# Altium project Choin1_0.PrjPCB (part 2 of 2)
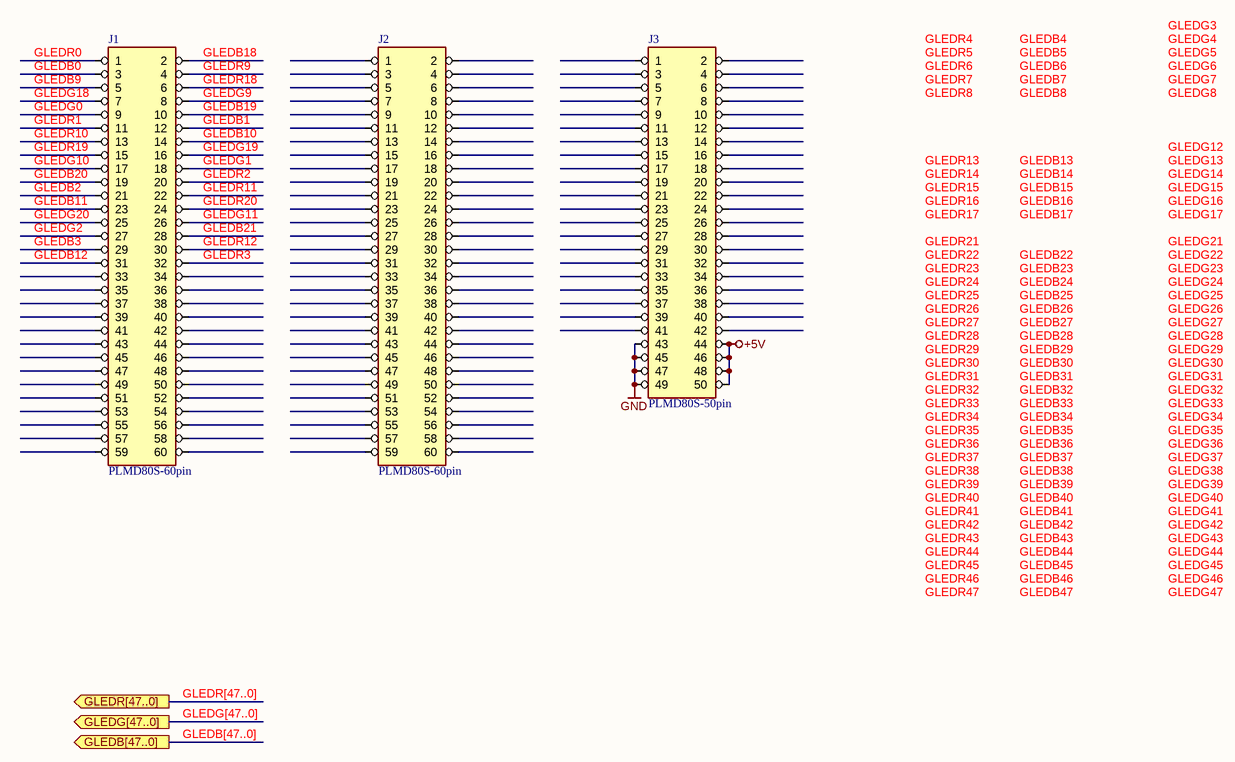
[diagram p5: Choin_zlacza.SchDoc]

## Nets that join several sheets
+5V: Choin_led1_0 (135 pins), Choin_zlacza (J3.44 J3.46 J3.48 J3.50)
GND: Choin_tran1_0 (192 pins), Choin_zlacza (J3.43 J3.45 J3.47 J3.49)
GLEDB0: Choin_tran1_0 (T1.5), Choin_zlacza (J1.3)
GLEDB1: Choin_tran1_0 (T3.5), Choin_zlacza (J1.12)
GLEDB2: Choin_tran1_0 (T5.5), Choin_zlacza (J1.21)
GLEDB3: Choin_tran1_0 (T7.5), Choin_zlacza (J1.29)
GLEDB9: Choin_tran1_0 (T19.5), Choin_zlacza (J1.5)
GLEDB10: Choin_tran1_0 (T21.5), Choin_zlacza (J1.14)
GLEDB11: Choin_tran1_0 (T23.5), Choin_zlacza (J1.23)
GLEDB12: Choin_tran1_0 (T25.5), Choin_zlacza (J1.31)
GLEDB18: Choin_tran1_0 (T37.5), Choin_zlacza (J1.2)
GLEDB19: Choin_tran1_0 (T39.5), Choin_zlacza (J1.10)
GLEDB20: Choin_tran1_0 (T41.5), Choin_zlacza (J1.19)
GLEDB21: Choin_tran1_0 (T43.5), Choin_zlacza (J1.28)
GLEDG0: Choin_tran1_0 (T2.2), Choin_zlacza (J1.9)
GLEDG1: Choin_tran1_0 (T4.2), Choin_zlacza (J1.18)
GLEDG2: Choin_tran1_0 (T6.2), Choin_zlacza (J1.27)
GLEDG9: Choin_tran1_0 (T20.2), Choin_zlacza (J1.8)
GLEDG10: Choin_tran1_0 (T22.2), Choin_zlacza (J1.17)
GLEDG11: Choin_tran1_0 (T24.2), Choin_zlacza (J1.26)
GLEDG18: Choin_tran1_0 (T38.2), Choin_zlacza (J1.7)
GLEDG19: Choin_tran1_0 (T40.2), Choin_zlacza (J1.16)
GLEDG20: Choin_tran1_0 (T42.2), Choin_zlacza (J1.25)
GLEDR0: Choin_tran1_0 (T1.2), Choin_zlacza (J1.1)
GLEDR1: Choin_tran1_0 (T3.2), Choin_zlacza (J1.11)
GLEDR2: Choin_tran1_0 (T5.2), Choin_zlacza (J1.20)
GLEDR3: Choin_tran1_0 (T7.2), Choin_zlacza (J1.32)
GLEDR9: Choin_tran1_0 (T19.2), Choin_zlacza (J1.4)
GLEDR10: Choin_tran1_0 (T21.2), Choin_zlacza (J1.13)
GLEDR11: Choin_tran1_0 (T23.2), Choin_zlacza (J1.22)
GLEDR12: Choin_tran1_0 (T25.2), Choin_zlacza (J1.30)
GLEDR18: Choin_tran1_0 (T37.2), Choin_zlacza (J1.6)
GLEDR19: Choin_tran1_0 (T39.2), Choin_zlacza (J1.15)
GLEDR20: Choin_tran1_0 (T41.2), Choin_zlacza (J1.24)
LEDB0: Choin_led1_0 (D1.4), Choin_rez1_0 (R1.5)
LEDB1: Choin_led1_0 (D2.4), Choin_rez1_0 (R2.5)
LEDB2: Choin_led1_0 (D3.4), Choin_rez1_0 (R3.5)
LEDB3: Choin_led1_0 (D4.4), Choin_rez1_0 (R4.5)
LEDB4: Choin_led1_0 (D5.4), Choin_rez1_0 (R5.5)
LEDB5: Choin_led1_0 (D6.4), Choin_rez1_0 (R6.5)
LEDB6: Choin_led1_0 (D7.4), Choin_rez1_0 (R7.5)
LEDB7: Choin_led1_0 (D8.4), Choin_rez1_0 (R8.5)
LEDB8: Choin_led1_0 (D9.4), Choin_rez1_0 (R9.5)
LEDB9: Choin_led1_0 (D10.4), Choin_rez1_0 (R10.5)
LEDB10: Choin_led1_0 (D11.4), Choin_rez1_0 (R11.5)
LEDB11: Choin_led1_0 (D12.4), Choin_rez1_0 (R12.5)
LEDB12: Choin_led1_0 (D13.4), Choin_rez1_0 (R13.5)
LEDB13: Choin_led1_0 (D14.4), Choin_rez1_0 (R14.5)
LEDB14: Choin_led1_0 (D15.4), Choin_rez1_0 (R15.5)
LEDB15: Choin_led1_0 (D16.4), Choin_rez1_0 (R16.5)
LEDB16: Choin_led1_0 (D17.4), Choin_rez1_0 (R17.5)
LEDB17: Choin_led1_0 (D18.4), Choin_rez1_0 (R18.5)
LEDB18: Choin_led1_0 (D19.4), Choin_rez1_0 (R19.5)
LEDB19: Choin_led1_0 (D20.4), Choin_rez1_0 (R20.5)
LEDB20: Choin_led1_0 (D21.4), Choin_rez1_0 (R21.5)
LEDB21: Choin_led1_0 (D22.4), Choin_rez1_0 (R22.5)
LEDB22: Choin_led1_0 (D23.4), Choin_rez1_0 (R23.5)
LEDB23: Choin_led1_0 (D24.4), Choin_rez1_0 (R24.5)
LEDB24: Choin_led1_0 (D25.4), Choin_rez1_0 (R25.5)
LEDB25: Choin_led1_0 (D26.4), Choin_rez1_0 (R26.5)
LEDB26: Choin_led1_0 (D27.4), Choin_rez1_0 (R27.5)
LEDB27: Choin_led1_0 (D28.4), Choin_rez1_0 (R28.5)
LEDB28: Choin_led1_0 (D29.4), Choin_rez1_0 (R29.5)
LEDB29: Choin_led1_0 (D30.4), Choin_rez1_0 (R30.5)
LEDB30: Choin_led1_0 (D31.4), Choin_rez1_0 (R31.5)
LEDB31: Choin_led1_0 (D32.4), Choin_rez1_0 (R32.5)
LEDB32: Choin_led1_0 (D33.4), Choin_rez1_0 (R33.5)
LEDB33: Choin_led1_0 (D34.4), Choin_rez1_0 (R34.5)
LEDB34: Choin_led1_0 (D35.4), Choin_rez1_0 (R35.5)
LEDB35: Choin_led1_0 (D36.4), Choin_rez1_0 (R36.5)
LEDB36: Choin_led1_0 (D37.4), Choin_rez1_0 (R37.5)
LEDB37: Choin_led1_0 (D38.4), Choin_rez1_0 (R38.5)
LEDB38: Choin_led1_0 (D39.4), Choin_rez1_0 (R39.5)
LEDB39: Choin_led1_0 (D40.4), Choin_rez1_0 (R40.5)
LEDB40: Choin_led1_0 (D41.4), Choin_rez1_0 (R41.5)
LEDB41: Choin_led1_0 (D42.4), Choin_rez1_0 (R42.5)
LEDB42: Choin_led1_0 (D43.4), Choin_rez1_0 (R43.5)
LEDB43: Choin_led1_0 (D44.4), Choin_rez1_0 (R44.5)
LEDB44: Choin_led1_0 (D45.4), Choin_rez1_0 (R45.5)
LEDB45: Choin_led1_0 (D46.4), Choin_rez1_0 (R46.5)
LEDB46: Choin_led1_0 (D47.4), Choin_rez1_0 (R47.5)
LEDB47: Choin_led1_0 (D48.4), Choin_rez1_0 (R48.5)
LEDG0: Choin_led1_0 (D1.6), Choin_rez1_0 (R1.8)
LEDG1: Choin_led1_0 (D2.6), Choin_rez1_0 (R2.8)
LEDG2: Choin_led1_0 (D3.6), Choin_rez1_0 (R3.8)
LEDG3: Choin_led1_0 (D4.6), Choin_rez1_0 (R4.8)
LEDG4: Choin_led1_0 (D5.6), Choin_rez1_0 (R5.8)
LEDG5: Choin_led1_0 (D6.6), Choin_rez1_0 (R6.8)
LEDG6: Choin_led1_0 (D7.6), Choin_rez1_0 (R7.8)
LEDG7: Choin_led1_0 (D8.6), Choin_rez1_0 (R8.8)
LEDG8: Choin_led1_0 (D9.6), Choin_rez1_0 (R9.8)
LEDG9: Choin_led1_0 (D10.6), Choin_rez1_0 (R10.8)
LEDG10: Choin_led1_0 (D11.6), Choin_rez1_0 (R11.8)
LEDG11: Choin_led1_0 (D12.6), Choin_rez1_0 (R12.8)
LEDG12: Choin_led1_0 (D13.6), Choin_rez1_0 (R13.8)
LEDG13: Choin_led1_0 (D14.6), Choin_rez1_0 (R14.8)
LEDG14: Choin_led1_0 (D15.6), Choin_rez1_0 (R15.8)
LEDG15: Choin_led1_0 (D16.6), Choin_rez1_0 (R16.8)
LEDG16: Choin_led1_0 (D17.6), Choin_rez1_0 (R17.8)
LEDG17: Choin_led1_0 (D18.6), Choin_rez1_0 (R18.8)
LEDG18: Choin_led1_0 (D19.6), Choin_rez1_0 (R19.8)
LEDG19: Choin_led1_0 (D20.6), Choin_rez1_0 (R20.8)
LEDG20: Choin_led1_0 (D21.6), Choin_rez1_0 (R21.8)
LEDG21: Choin_led1_0 (D22.6), Choin_rez1_0 (R22.8)
LEDG22: Choin_led1_0 (D23.6), Choin_rez1_0 (R23.8)
LEDG23: Choin_led1_0 (D24.6), Choin_rez1_0 (R24.8)
LEDG24: Choin_led1_0 (D25.6), Choin_rez1_0 (R25.8)
LEDG25: Choin_led1_0 (D26.6), Choin_rez1_0 (R26.8)
LEDG26: Choin_led1_0 (D27.6), Choin_rez1_0 (R27.8)
LEDG27: Choin_led1_0 (D28.6), Choin_rez1_0 (R28.8)
LEDG28: Choin_led1_0 (D29.6), Choin_rez1_0 (R29.8)
LEDG29: Choin_led1_0 (D30.6), Choin_rez1_0 (R30.8)
LEDG30: Choin_led1_0 (D31.6), Choin_rez1_0 (R31.8)
LEDG31: Choin_led1_0 (D32.6), Choin_rez1_0 (R32.8)
LEDG32: Choin_led1_0 (D33.6), Choin_rez1_0 (R33.8)
LEDG33: Choin_led1_0 (D34.6), Choin_rez1_0 (R34.8)
LEDG34: Choin_led1_0 (D35.6), Choin_rez1_0 (R35.8)
LEDG35: Choin_led1_0 (D36.6), Choin_rez1_0 (R36.8)
LEDG36: Choin_led1_0 (D37.6), Choin_rez1_0 (R37.8)
LEDG37: Choin_led1_0 (D38.6), Choin_rez1_0 (R38.8)
LEDG38: Choin_led1_0 (D39.6), Choin_rez1_0 (R39.8)
LEDG39: Choin_led1_0 (D40.6), Choin_rez1_0 (R40.8)
LEDG40: Choin_led1_0 (D41.6), Choin_rez1_0 (R41.8)
LEDG41: Choin_led1_0 (D42.6), Choin_rez1_0 (R42.8)
LEDG42: Choin_led1_0 (D43.6), Choin_rez1_0 (R43.8)
LEDG43: Choin_led1_0 (D44.6), Choin_rez1_0 (R44.8)
LEDG44: Choin_led1_0 (D45.6), Choin_rez1_0 (R45.8)
LEDG45: Choin_led1_0 (D46.6), Choin_rez1_0 (R46.8)
LEDG46: Choin_led1_0 (D47.6), Choin_rez1_0 (R47.8)
LEDG47: Choin_led1_0 (D48.6), Choin_rez1_0 (R48.8)
LEDR0: Choin_led1_0 (D1.5), Choin_rez1_0 (R1.6)
LEDR1: Choin_led1_0 (D2.5), Choin_rez1_0 (R2.6)
LEDR2: Choin_led1_0 (D3.5), Choin_rez1_0 (R3.6)
LEDR3: Choin_led1_0 (D4.5), Choin_rez1_0 (R4.6)
LEDR4: Choin_led1_0 (D5.5), Choin_rez1_0 (R5.6)
LEDR5: Choin_led1_0 (D6.5), Choin_rez1_0 (R6.6)
LEDR6: Choin_led1_0 (D7.5), Choin_rez1_0 (R7.6)
LEDR7: Choin_led1_0 (D8.5), Choin_rez1_0 (R8.6)
LEDR8: Choin_led1_0 (D9.5), Choin_rez1_0 (R9.6)
LEDR9: Choin_led1_0 (D10.5), Choin_rez1_0 (R10.6)
LEDR10: Choin_led1_0 (D11.5), Choin_rez1_0 (R11.6)
LEDR11: Choin_led1_0 (D12.5), Choin_rez1_0 (R12.6)
LEDR12: Choin_led1_0 (D13.5), Choin_rez1_0 (R13.6)
LEDR13: Choin_led1_0 (D14.5), Choin_rez1_0 (R14.6)
LEDR14: Choin_led1_0 (D15.5), Choin_rez1_0 (R15.6)
LEDR15: Choin_led1_0 (D16.5), Choin_rez1_0 (R16.6)
LEDR16: Choin_led1_0 (D17.5), Choin_rez1_0 (R17.6)
LEDR17: Choin_led1_0 (D18.5), Choin_rez1_0 (R18.6)
LEDR18: Choin_led1_0 (D19.5), Choin_rez1_0 (R19.6)
LEDR19: Choin_led1_0 (D20.5), Choin_rez1_0 (R20.6)
LEDR20: Choin_led1_0 (D21.5), Choin_rez1_0 (R21.6)
LEDR21: Choin_led1_0 (D22.5), Choin_rez1_0 (R22.6)
LEDR22: Choin_led1_0 (D23.5), Choin_rez1_0 (R23.6)
LEDR23: Choin_led1_0 (D24.5), Choin_rez1_0 (R24.6)
LEDR24: Choin_led1_0 (D25.5), Choin_rez1_0 (R25.6)
LEDR25: Choin_led1_0 (D26.5), Choin_rez1_0 (R26.6)
LEDR26: Choin_led1_0 (D27.5), Choin_rez1_0 (R27.6)
LEDR27: Choin_led1_0 (D28.5), Choin_rez1_0 (R28.6)
LEDR28: Choin_led1_0 (D29.5), Choin_rez1_0 (R29.6)
LEDR29: Choin_led1_0 (D30.5), Choin_rez1_0 (R30.6)
LEDR30: Choin_led1_0 (D31.5), Choin_rez1_0 (R31.6)
LEDR31: Choin_led1_0 (D32.5), Choin_rez1_0 (R32.6)
LEDR32: Choin_led1_0 (D33.5), Choin_rez1_0 (R33.6)
LEDR33: Choin_led1_0 (D34.5), Choin_rez1_0 (R34.6)
LEDR34: Choin_led1_0 (D35.5), Choin_rez1_0 (R35.6)
LEDR35: Choin_led1_0 (D36.5), Choin_rez1_0 (R36.6)
LEDR36: Choin_led1_0 (D37.5), Choin_rez1_0 (R37.6)
LEDR37: Choin_led1_0 (D38.5), Choin_rez1_0 (R38.6)
LEDR38: Choin_led1_0 (D39.5), Choin_rez1_0 (R39.6)
LEDR39: Choin_led1_0 (D40.5), Choin_rez1_0 (R40.6)
LEDR40: Choin_led1_0 (D41.5), Choin_rez1_0 (R41.6)
LEDR41: Choin_led1_0 (D42.5), Choin_rez1_0 (R42.6)
LEDR42: Choin_led1_0 (D43.5), Choin_rez1_0 (R43.6)
LEDR43: Choin_led1_0 (D44.5), Choin_rez1_0 (R44.6)
LEDR44: Choin_led1_0 (D45.5), Choin_rez1_0 (R45.6)
LEDR45: Choin_led1_0 (D46.5), Choin_rez1_0 (R46.6)
LEDR46: Choin_led1_0 (D47.5), Choin_rez1_0 (R47.6)
LEDR47: Choin_led1_0 (D48.5), Choin_rez1_0 (R48.6)
RLEDB0: Choin_tran1_0 (T1.3 T1.8), Choin_rez1_0 (R1.4)
RLEDB1: Choin_tran1_0 (T3.3 T3.8), Choin_rez1_0 (R2.4)
RLEDB2: Choin_tran1_0 (T5.3 T5.8), Choin_rez1_0 (R3.4)
RLEDB3: Choin_tran1_0 (T7.3 T7.8), Choin_rez1_0 (R4.4)
RLEDB4: Choin_tran1_0 (T9.3 T9.8), Choin_rez1_0 (R5.4)
RLEDB5: Choin_tran1_0 (T11.3 T11.8), Choin_rez1_0 (R6.4)
RLEDB6: Choin_tran1_0 (T13.3 T13.8), Choin_rez1_0 (R7.4)
RLEDB7: Choin_tran1_0 (T15.3 T15.8), Choin_rez1_0 (R8.4)
RLEDB8: Choin_tran1_0 (T17.3 T17.8), Choin_rez1_0 (R9.4)
RLEDB9: Choin_tran1_0 (T19.3 T19.8), Choin_rez1_0 (R10.4)
RLEDB10: Choin_tran1_0 (T21.3 T21.8), Choin_rez1_0 (R11.4)
RLEDB11: Choin_tran1_0 (T23.3 T23.8), Choin_rez1_0 (R12.4)
RLEDB12: Choin_tran1_0 (T25.3 T25.8), Choin_rez1_0 (R13.4)
RLEDB13: Choin_tran1_0 (T27.3 T27.8), Choin_rez1_0 (R14.4)
RLEDB14: Choin_tran1_0 (T29.3 T29.8), Choin_rez1_0 (R15.4)
RLEDB15: Choin_tran1_0 (T31.3 T31.8), Choin_rez1_0 (R16.4)
RLEDB16: Choin_tran1_0 (T33.3 T33.8), Choin_rez1_0 (R17.4)
RLEDB17: Choin_tran1_0 (T35.3 T35.8), Choin_rez1_0 (R18.4)
RLEDB18: Choin_tran1_0 (T37.3 T37.8), Choin_rez1_0 (R19.4)
RLEDB19: Choin_tran1_0 (T39.3 T39.8), Choin_rez1_0 (R20.4)
RLEDB20: Choin_tran1_0 (T41.3 T41.8), Choin_rez1_0 (R21.4)
RLEDB21: Choin_tran1_0 (T43.3 T43.8), Choin_rez1_0 (R22.4)
RLEDB22: Choin_tran1_0 (T45.3 T45.8), Choin_rez1_0 (R23.4)
RLEDB23: Choin_tran1_0 (T47.3 T47.8), Choin_rez1_0 (R24.4)
RLEDB24: Choin_tran1_0 (T49.3 T49.8), Choin_rez1_0 (R25.4)
RLEDB25: Choin_tran1_0 (T51.3 T51.8), Choin_rez1_0 (R26.4)
RLEDB26: Choin_tran1_0 (T53.3 T53.8), Choin_rez1_0 (R27.4)
RLEDB27: Choin_tran1_0 (T55.3 T55.8), Choin_rez1_0 (R28.4)
RLEDB28: Choin_tran1_0 (T57.3 T57.8), Choin_rez1_0 (R29.4)
RLEDB29: Choin_tran1_0 (T59.3 T59.8), Choin_rez1_0 (R30.4)
RLEDB30: Choin_tran1_0 (T61.3 T61.8), Choin_rez1_0 (R31.4)
RLEDB31: Choin_tran1_0 (T63.3 T63.8), Choin_rez1_0 (R32.4)
RLEDB32: Choin_tran1_0 (T65.3 T65.8), Choin_rez1_0 (R33.4)
RLEDB33: Choin_tran1_0 (T67.3 T67.8), Choin_rez1_0 (R34.4)
RLEDB34: Choin_tran1_0 (T69.3 T69.8), Choin_rez1_0 (R35.4)
RLEDB35: Choin_tran1_0 (T71.3 T71.8), Choin_rez1_0 (R36.4)
RLEDB36: Choin_tran1_0 (T73.3 T73.8), Choin_rez1_0 (R37.4)
RLEDB37: Choin_tran1_0 (T75.3 T75.8), Choin_rez1_0 (R38.4)
RLEDB38: Choin_tran1_0 (T77.3 T77.8), Choin_rez1_0 (R39.4)
RLEDB39: Choin_tran1_0 (T79.3 T79.8), Choin_rez1_0 (R40.4)
RLEDB40: Choin_tran1_0 (T81.3 T81.8), Choin_rez1_0 (R41.4)
RLEDB41: Choin_tran1_0 (T83.3 T83.8), Choin_rez1_0 (R42.4)
RLEDB42: Choin_tran1_0 (T85.3 T85.8), Choin_rez1_0 (R43.4)
RLEDB43: Choin_tran1_0 (T87.3 T87.8), Choin_rez1_0 (R44.4)
RLEDB44: Choin_tran1_0 (T89.3 T89.8), Choin_rez1_0 (R45.4)
RLEDB45: Choin_tran1_0 (T91.3 T91.8), Choin_rez1_0 (R46.4)
RLEDB46: Choin_tran1_0 (T93.3 T93.8), Choin_rez1_0 (R47.4)
RLEDB47: Choin_tran1_0 (T95.3 T95.8), Choin_rez1_0 (R48.4)
RLEDG0: Choin_tran1_0 (T2.6 T2.7), Choin_rez1_0 (R1.1)
RLEDG1: Choin_tran1_0 (T4.6 T4.7), Choin_rez1_0 (R2.1)
RLEDG2: Choin_tran1_0 (T6.6 T6.7), Choin_rez1_0 (R3.1)
RLEDG3: Choin_tran1_0 (T8.6 T8.7), Choin_rez1_0 (R4.1)
RLEDG4: Choin_tran1_0 (T10.6 T10.7), Choin_rez1_0 (R5.1)
RLEDG5: Choin_tran1_0 (T12.6 T12.7), Choin_rez1_0 (R6.1)
RLEDG6: Choin_tran1_0 (T14.6 T14.7), Choin_rez1_0 (R7.1)
RLEDG7: Choin_tran1_0 (T16.6 T16.7), Choin_rez1_0 (R8.1)
RLEDG8: Choin_tran1_0 (T18.6 T18.7), Choin_rez1_0 (R9.1)
RLEDG9: Choin_tran1_0 (T20.6 T20.7), Choin_rez1_0 (R10.1)
RLEDG10: Choin_tran1_0 (T22.6 T22.7), Choin_rez1_0 (R11.1)
RLEDG11: Choin_tran1_0 (T24.6 T24.7), Choin_rez1_0 (R12.1)
RLEDG12: Choin_tran1_0 (T26.6 T26.7), Choin_rez1_0 (R13.1)
RLEDG13: Choin_tran1_0 (T28.6 T28.7), Choin_rez1_0 (R14.1)
RLEDG14: Choin_tran1_0 (T30.6 T30.7), Choin_rez1_0 (R15.1)
RLEDG15: Choin_tran1_0 (T32.6 T32.7), Choin_rez1_0 (R16.1)
RLEDG16: Choin_tran1_0 (T34.6 T34.7), Choin_rez1_0 (R17.1)
RLEDG17: Choin_tran1_0 (T36.6 T36.7), Choin_rez1_0 (R18.1)
RLEDG18: Choin_tran1_0 (T38.6 T38.7), Choin_rez1_0 (R19.1)
RLEDG19: Choin_tran1_0 (T40.6 T40.7), Choin_rez1_0 (R20.1)
RLEDG20: Choin_tran1_0 (T42.6 T42.7), Choin_rez1_0 (R21.1)
RLEDG21: Choin_tran1_0 (T44.6 T44.7), Choin_rez1_0 (R22.1)
RLEDG22: Choin_tran1_0 (T46.6 T46.7), Choin_rez1_0 (R23.1)
RLEDG23: Choin_tran1_0 (T48.6 T48.7), Choin_rez1_0 (R24.1)
RLEDG24: Choin_tran1_0 (T50.6 T50.7), Choin_rez1_0 (R25.1)
RLEDG25: Choin_tran1_0 (T52.6 T52.7), Choin_rez1_0 (R26.1)
RLEDG26: Choin_tran1_0 (T54.6 T54.7), Choin_rez1_0 (R27.1)
RLEDG27: Choin_tran1_0 (T56.6 T56.7), Choin_rez1_0 (R28.1)
RLEDG28: Choin_tran1_0 (T58.6 T58.7), Choin_rez1_0 (R29.1)
RLEDG29: Choin_tran1_0 (T60.6 T60.7), Choin_rez1_0 (R30.1)
RLEDG30: Choin_tran1_0 (T62.6 T62.7), Choin_rez1_0 (R31.1)
RLEDG31: Choin_tran1_0 (T64.6 T64.7), Choin_rez1_0 (R32.1)
RLEDG32: Choin_tran1_0 (T66.6 T66.7), Choin_rez1_0 (R33.1)
RLEDG33: Choin_tran1_0 (T68.6 T68.7), Choin_rez1_0 (R34.1)
RLEDG34: Choin_tran1_0 (T70.6 T70.7), Choin_rez1_0 (R35.1)
RLEDG35: Choin_tran1_0 (T72.6 T72.7), Choin_rez1_0 (R36.1)
RLEDG36: Choin_tran1_0 (T74.6 T74.7), Choin_rez1_0 (R37.1)
RLEDG37: Choin_tran1_0 (T76.6 T76.7), Choin_rez1_0 (R38.1)
RLEDG38: Choin_tran1_0 (T78.6 T78.7), Choin_rez1_0 (R39.1)
RLEDG39: Choin_tran1_0 (T80.6 T80.7), Choin_rez1_0 (R40.1)
RLEDG40: Choin_tran1_0 (T82.6 T82.7), Choin_rez1_0 (R41.1)
RLEDG41: Choin_tran1_0 (T84.6 T84.7), Choin_rez1_0 (R42.1)
RLEDG42: Choin_tran1_0 (T86.6 T86.7), Choin_rez1_0 (R43.1)
RLEDG43: Choin_tran1_0 (T88.6 T88.7), Choin_rez1_0 (R44.1)
RLEDG44: Choin_tran1_0 (T90.6 T90.7), Choin_rez1_0 (R45.1)
RLEDG45: Choin_tran1_0 (T92.6 T92.7), Choin_rez1_0 (R46.1)
RLEDG46: Choin_tran1_0 (T94.6 T94.7), Choin_rez1_0 (R47.1)
RLEDG47: Choin_tran1_0 (T96.6 T96.7), Choin_rez1_0 (R48.1)
RLEDR0: Choin_tran1_0 (T1.6 T1.7), Choin_rez1_0 (R1.3)
RLEDR1: Choin_tran1_0 (T3.6 T3.7), Choin_rez1_0 (R2.3)
RLEDR2: Choin_tran1_0 (T5.6 T5.7), Choin_rez1_0 (R3.3)
RLEDR3: Choin_tran1_0 (T7.6 T7.7), Choin_rez1_0 (R4.3)
RLEDR4: Choin_tran1_0 (T9.6 T9.7), Choin_rez1_0 (R5.3)
RLEDR5: Choin_tran1_0 (T11.6 T11.7), Choin_rez1_0 (R6.3)
RLEDR6: Choin_tran1_0 (T13.6 T13.7), Choin_rez1_0 (R7.3)
RLEDR7: Choin_tran1_0 (T15.6 T15.7), Choin_rez1_0 (R8.3)
RLEDR8: Choin_tran1_0 (T17.6 T17.7), Choin_rez1_0 (R9.3)
RLEDR9: Choin_tran1_0 (T19.6 T19.7), Choin_rez1_0 (R10.3)
RLEDR10: Choin_tran1_0 (T21.6 T21.7), Choin_rez1_0 (R11.3)
RLEDR11: Choin_tran1_0 (T23.6 T23.7), Choin_rez1_0 (R12.3)
RLEDR12: Choin_tran1_0 (T25.6 T25.7), Choin_rez1_0 (R13.3)
RLEDR13: Choin_tran1_0 (T27.6 T27.7), Choin_rez1_0 (R14.3)
RLEDR14: Choin_tran1_0 (T29.6 T29.7), Choin_rez1_0 (R15.3)
RLEDR15: Choin_tran1_0 (T31.6 T31.7), Choin_rez1_0 (R16.3)
RLEDR16: Choin_tran1_0 (T33.6 T33.7), Choin_rez1_0 (R17.3)
RLEDR17: Choin_tran1_0 (T35.6 T35.7), Choin_rez1_0 (R18.3)
RLEDR18: Choin_tran1_0 (T37.6 T37.7), Choin_rez1_0 (R19.3)
RLEDR19: Choin_tran1_0 (T39.6 T39.7), Choin_rez1_0 (R20.3)
RLEDR20: Choin_tran1_0 (T41.6 T41.7), Choin_rez1_0 (R21.3)
RLEDR21: Choin_tran1_0 (T43.6 T43.7), Choin_rez1_0 (R22.3)
RLEDR22: Choin_tran1_0 (T45.6 T45.7), Choin_rez1_0 (R23.3)
RLEDR23: Choin_tran1_0 (T47.6 T47.7), Choin_rez1_0 (R24.3)
RLEDR24: Choin_tran1_0 (T49.6 T49.7), Choin_rez1_0 (R25.3)
RLEDR25: Choin_tran1_0 (T51.6 T51.7), Choin_rez1_0 (R26.3)
RLEDR26: Choin_tran1_0 (T53.6 T53.7), Choin_rez1_0 (R27.3)
RLEDR27: Choin_tran1_0 (T55.6 T55.7), Choin_rez1_0 (R28.3)
RLEDR28: Choin_tran1_0 (T57.6 T57.7), Choin_rez1_0 (R29.3)
RLEDR29: Choin_tran1_0 (T59.6 T59.7), Choin_rez1_0 (R30.3)
RLEDR30: Choin_tran1_0 (T61.6 T61.7), Choin_rez1_0 (R31.3)
RLEDR31: Choin_tran1_0 (T63.6 T63.7), Choin_rez1_0 (R32.3)
RLEDR32: Choin_tran1_0 (T65.6 T65.7), Choin_rez1_0 (R33.3)
RLEDR33: Choin_tran1_0 (T67.6 T67.7), Choin_rez1_0 (R34.3)
RLEDR34: Choin_tran1_0 (T69.6 T69.7), Choin_rez1_0 (R35.3)
RLEDR35: Choin_tran1_0 (T71.6 T71.7), Choin_rez1_0 (R36.3)
RLEDR36: Choin_tran1_0 (T73.6 T73.7), Choin_rez1_0 (R37.3)
RLEDR37: Choin_tran1_0 (T75.6 T75.7), Choin_rez1_0 (R38.3)
RLEDR38: Choin_tran1_0 (T77.6 T77.7), Choin_rez1_0 (R39.3)
RLEDR39: Choin_tran1_0 (T79.6 T79.7), Choin_rez1_0 (R40.3)
RLEDR40: Choin_tran1_0 (T81.6 T81.7), Choin_rez1_0 (R41.3)
RLEDR41: Choin_tran1_0 (T83.6 T83.7), Choin_rez1_0 (R42.3)
RLEDR42: Choin_tran1_0 (T85.6 T85.7), Choin_rez1_0 (R43.3)
RLEDR43: Choin_tran1_0 (T87.6 T87.7), Choin_rez1_0 (R44.3)
RLEDR44: Choin_tran1_0 (T89.6 T89.7), Choin_rez1_0 (R45.3)
RLEDR45: Choin_tran1_0 (T91.6 T91.7), Choin_rez1_0 (R46.3)
RLEDR46: Choin_tran1_0 (T93.6 T93.7), Choin_rez1_0 (R47.3)
RLEDR47: Choin_tran1_0 (T95.6 T95.7), Choin_rez1_0 (R48.3)